# EAGLE schematic CHARGE (EAGLE 9.3.0)
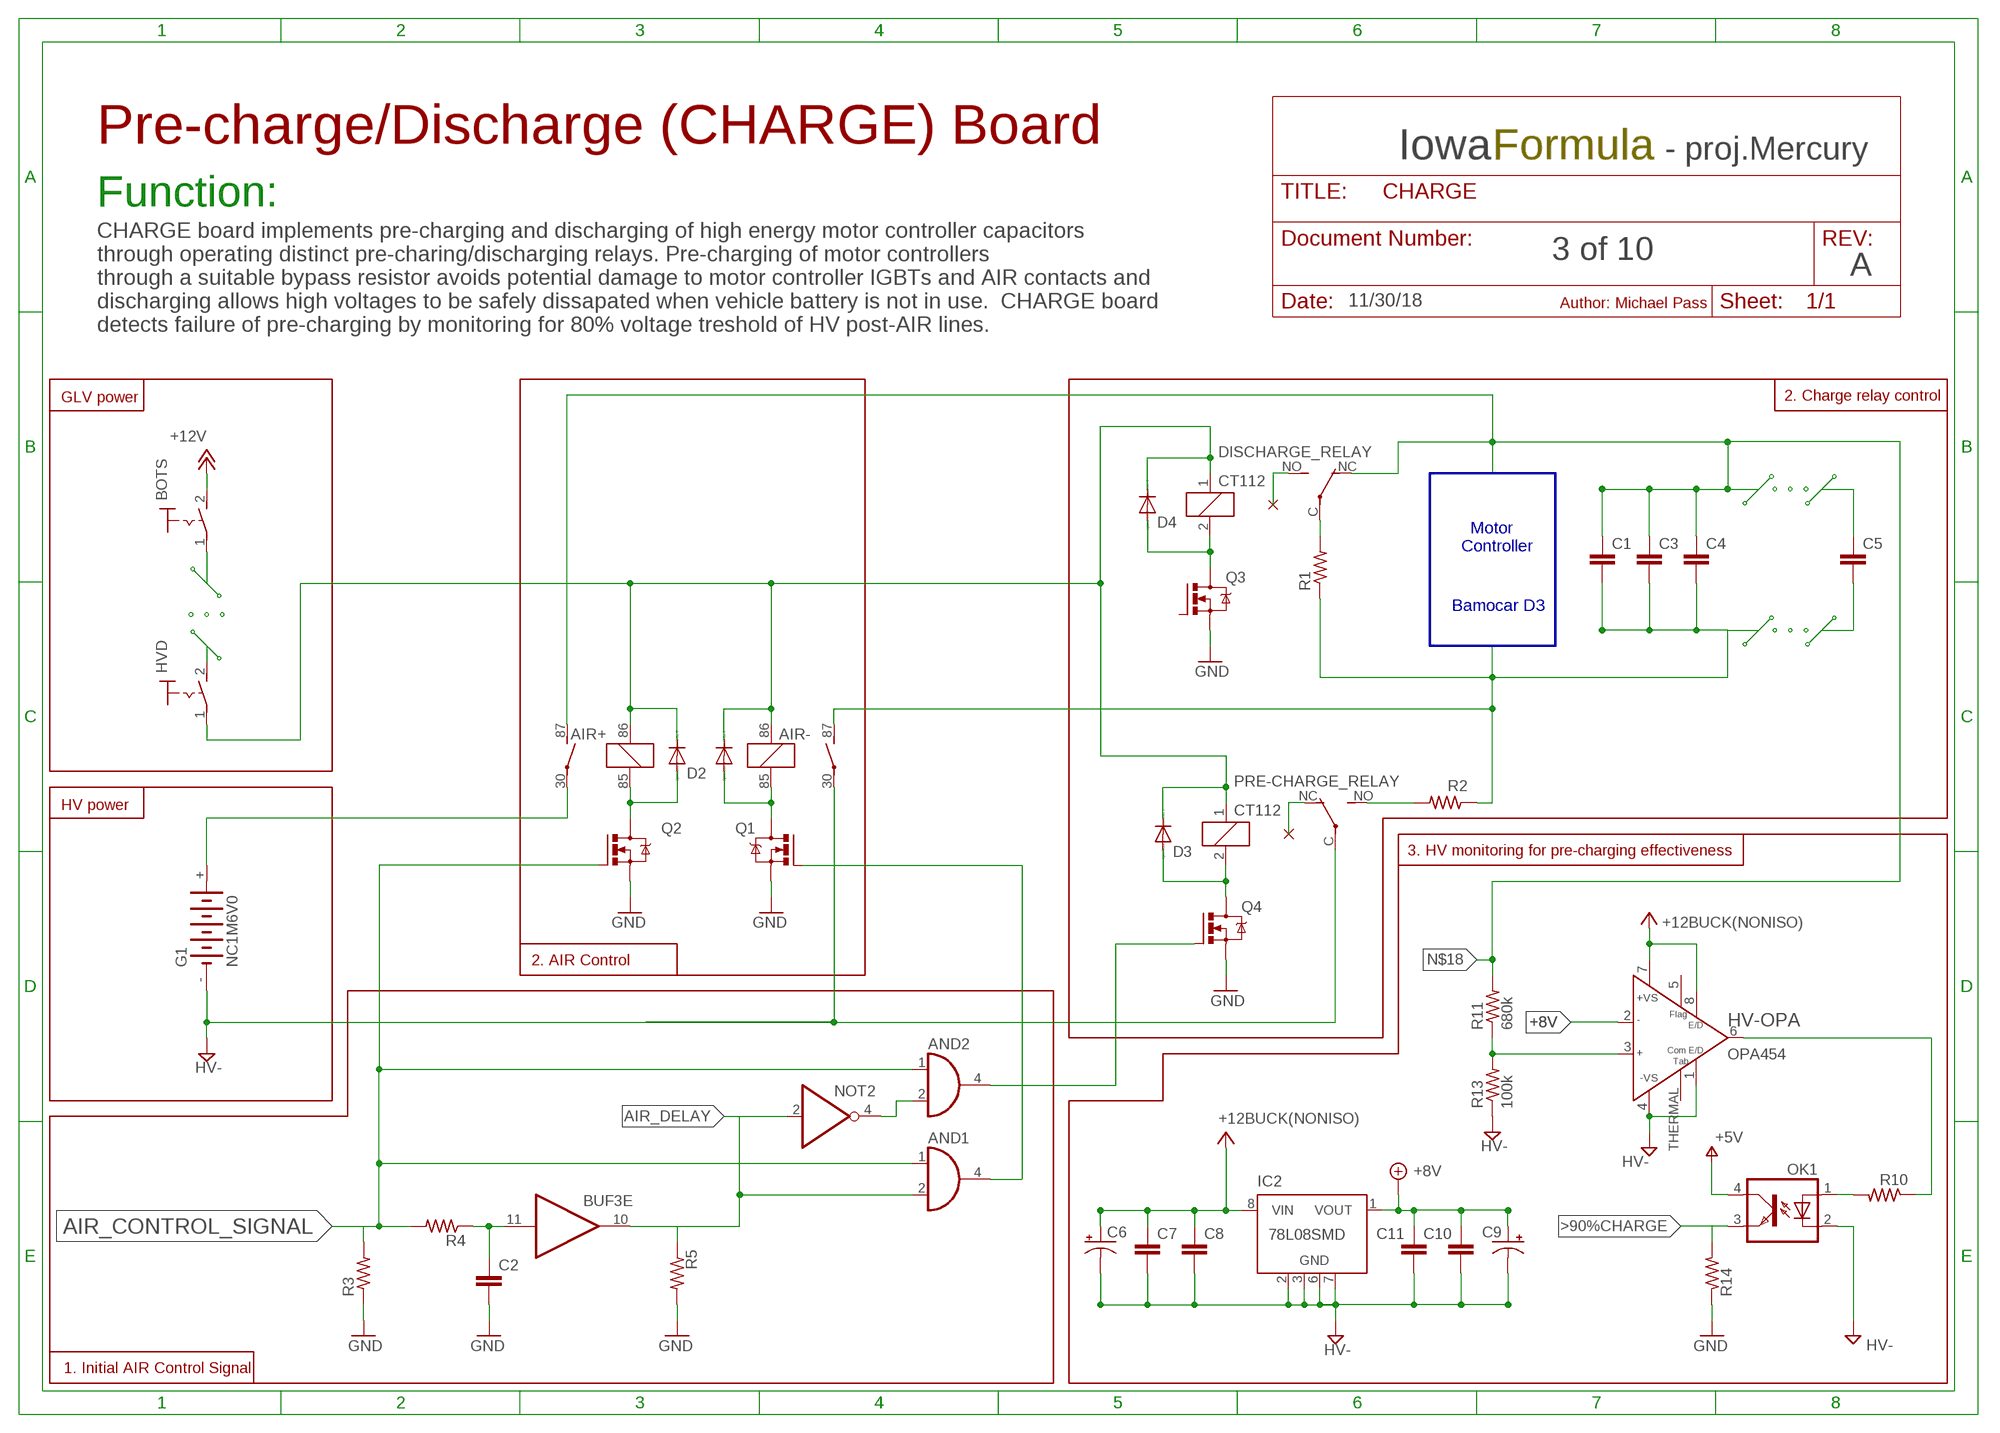
[diagram p0: schematic, sheet 1]

## Parts
AIR+  CB1A-P-12V  [CB1]
AIR-  CB1A-P-12V  [CB1]
AND1  74AHCT1G08DCK  [SC70-5]
AND2  74AHCT1G08DCK  [SC70-5]
BOTS  MS243  [MS243]
BUF3  7407D  [SO14]
C1  C-EU025-060X050  [C025-060X050]
C2  C-EUC0805  [C0805]
C3  C-EU025-060X050  [C025-060X050]
C4  C-EU025-060X050  [C025-060X050]
C5  C-EU025-060X050  [C025-060X050]
C6  10uF  CPOL-US085CS-1AW  [085CS_1AW]
C7  0.1uF  C-EUC0805  [C0805]
C8  0.1uF  C-EUC0805  [C0805]
C9  10uF  CPOL-US085CS-1AW  [085CS_1AW]
C10  0.1uF  C-EUC0805  [C0805]
C11  0.1uF  C-EUC0805  [C0805]
D1  1N4933  [DO41-10]
D2  1N4933  [DO41-10]
D3  1N4933  [DO41-10]
D4  1N4933  [DO41-10]
DISCHARGE_RELAY  CT112  [CT-SLIM]
G1  NC1M6V0  [NC1M]
HV-OPA  OPA454  [SO08GP]
HVD  MS243  [MS243]
IC2  78L08SMD  [SO08]
NOT2  74LVC1G06DCK  [SC70-5]
OK1  PC817-S  [SOP04(2.54)]
PRE-CHARGE_RELAY  CT112  [CT-SLIM]
Q1  IRLZ44Z  [TO220BH]
Q2  IRLZ44Z  [TO220BH]
Q3  IRLZ44Z  [TO220BH]
Q4  IRLZ44Z  [TO220BH]
R1  R-US_0309/12  [0309/12]
R2  R-US_0309/12  [0309/12]
R3  R-US_R0805  [R0805]
R4  R-US_R0805  [R0805]
R5  R-US_R0805  [R0805]
R10  R-US_R0805  [R0805]
R11  680k  R-US_R0805  [R0805]
R13  100k  R-US_R0805  [R0805]
R14  R-US_R0805  [R0805]

## Nets
+8V: C9.+ C10.1 C11.1 HV-OPA.2(IN-) IC2.1(VOUT)
+12V: BOTS.2(S)
>90%CHARGE: OK1.3(EMIT) R14.2
AIR_CONTROL_SIGNAL: AND1.1(I0) AND2.1(I0) Q2.G R3.2 R4.2
AIR_DELAY: AND1.2(I1) BUF3.10(E:O) NOT2.2(I) R5.1
GND: AIR-.30(2:P) C2.2 G1.- OK1.2(C) PRE-CHARGE_RELAY.C(2:P) Q1.S Q2.S Q3.S Q4.S R3.1 R5.2 R13.1 R14.1 ; supply symbol labelled HV-
HV+: AIR+.30(2:P) G1.+
HV-: C6.- C7.2 C8.2 C9.- C10.2 C11.2 HV-OPA.1(E/DCOM) HV-OPA.4(-VS) IC2.2(GND) IC2.3(GND) IC2.6(GND) IC2.7(GND)
HV-_CONTROL: AND1.4(O) Q1.G
N$1: PRE-CHARGE_RELAY.NO(2:S) R2.2
N$2: AND2.4(O) Q4.G
N$3: D3.A PRE-CHARGE_RELAY.2 Q4.D
N$4: PRE-CHARGE_RELAY.NC(2:O)
N$7: AIR+.85 D2.A Q2.D
N$8: HV-OPA.6(OUT) R10.1
N$9: AIR-.85 D1.A Q1.D
N$11: D4.A DISCHARGE_RELAY.2 Q3.D
N$12: BOTS.1(P)
N$13: HVD.2(S)
N$14: AIR+.86 AIR-.86 D1.C D2.C D3.C D4.C DISCHARGE_RELAY.1 HVD.1(P) PRE-CHARGE_RELAY.1
N$15: DISCHARGE_RELAY.NO(2:S)
N$16: DISCHARGE_RELAY.C(2:P) R1.2
N$17: OK1.1(A) R10.2
N$18: AIR+.87(2:S) C1.1 C3.1 C4.1 DISCHARGE_RELAY.NC(2:O) R11.2
N$20: BUF3.11(E:I) C2.1 R4.1
N$21: AND2.2(I1) NOT2.4(O)
N$22: C5.2
N$23: C5.1
N$24: AIR-.87(2:S) C1.2 C3.2 C4.2 R1.1 R2.1
V+: C6.+ C7.1 C8.1 HV-OPA.7(+VS) HV-OPA.8(E/D) IC2.8(VIN) OK1.4(COL) ; supply symbol labelled +12BUCK(NONISO), +5V
VDIV_SIGNAL: HV-OPA.3(IN+) R11.1 R13.2
Unconnected: BUF3.1(A:I) BUF3.2(A:O) BUF3.3(B:I) BUF3.4(B:O) BUF3.5(C:I) BUF3.6(C:O) BUF3.8(D:O) BUF3.9(D:I) BUF3.12(F:O) BUF3.13(F:I) HV-OPA.5(STATUS) HV-OPA.THERMAL(E/DCOM1) IC2.4(NC) IC2.5(NC) Q3.G

## Buses
+8V,+12V,>90%CHARGE,AIR_CONTROL_SIGNAL,AIR_DELAY,GND,HV-,HV+,HV-_CONTROL,N$1,N$2,N$3,N$4,N$5,N$6,N$7,N$8,N$9,N$11,N$12,N$13,N$14,N$15,N$16,N$17,N$18,N$20,N$21,N$22,N$23,N$24,TEST,V+,VDIV_SIGNAL

## Notes on the sheet
- Pre-charge/Discharge (CHARGE) Board
- Iowa | Formula | - proj.Mercury
- Function:
- 3 of 10
- A
- 11/30/18 | Author: Michael Pass
- CHARGE board implements pre-charging and discharging of high energy motor controller capacitors
  through operating distinct pre-charing/discharging relays. Pre-charging of motor controllers
  through a suitable bypass resistor avoids potential damage to motor controller IGBTs and AIR contacts and
  discharging allows high voltages to be safely dissapated when vehicle battery is not in use.  CHARGE board
  detects failure of pre-charging by monitoring for 80% voltage treshold of HV post-AIR lines.
- GLV power | 2. Charge relay control
- Motor 
  Controller
- Bamocar D3
- HV power
- 3. HV monitoring for pre-charging effectiveness
- 2. AIR Control
- 1. Initial AIR Control Signal

## Power pins joined to a net without a drawn wire
GND: AND1.3(GND) AND2.3(GND) BUF3.7(P:GND) NOT2.3(GND)
VCC: AND1.5(VCC) AND2.5(VCC) BUF3.14(P:VCC) NOT2.5(VCC)

## Library data of the parts
AIR+ AIR- = relay:CB*: HIGH POWER AUTOMOTIVE RELAY Form A NAiS Source: http://www.mew-europe.com/.. en_ds_61202_0000.pdf; MF: AROMAT/ MATSUSHITA; MPN: CB1A-P-12V; OC_FARNELL: 1270582; OC_NEWARK: 50B849
AND1 AND2 = 74xx-little-de:74*1G08: 2-input AND gate
BOTS HVD = switch:MS243: TOGGLE SWITCH
BUF3 = 74xx-eu:74*07: Hex BUFFER, open collector high-voltage output
C1-C5 C7 C8 C10 C11 = rcl:C-EU: CAPACITOR, European symbol; SPICEPREFIX: C
C6 C9 = rcl:CPOL-US: POLARIZED CAPACITOR, American symbol; SPICEPREFIX: C
D1-D4 = diode:1N4933: DIODE fast recovery rectifier, 1A
DISCHARGE_RELAY PRE-CHARGE_RELAY = relay:CT112: ULTRA SMALL AUTOMOTIVE RELAY NAiS Slim 1c type en_ds_61205_0000.pdf; OC_FARNELL: unknown; OC_NEWARK: unknown
G1 = battery:NC1M6V0: NC ACCU Sonnenschein Mini-Memo NC-M 6.0V R5
HV-OPA = OPA454:OPA454: TexasInstruments High-Voltage (100V), High-Current (50mA) Operatioanl Amplifier, G = 1 Stable http://focus.ti.com/lit/ds/symlink/opa454.pdf; AVAILABILITY: Unavailable; DESCRIPTION: High Voltage _100V_ High-Current _50mA_ Operational Amplifiers G=1 Stable; MF: Texas Instruments; MP: OPA454; PACKAGE: None; PRICE: None
IC2 = linear:78L*SMD: Positive VOLTAGE REGULATOR
NOT2 = 74xx-little-de:74*1G06: Single Inverter Buffer/Driver With Open-Drain Output
OK1 = iowaFormula:PC817-S: SHARP OPTO COUPLER
Q1-Q4 = transistor-power:IRLZ44Z: N-Channel HEXFET® Power MOSFET Logic Level AUTOMOTIVE MOSFET Source: http://www.irf.com/product-info/datasheets/data/irlz44zpbf.pdf
R1-R5 R10 R11 R13 R14 = rcl:R-US_: RESISTOR, American symbol; SPICEPREFIX: R